# Altium schematic sheet Motor_Power.SchDoc
size A3; DrawnBy: Caner ALP; DocumentNumber: 3; SheetNumber: 3; SheetTotal: 4
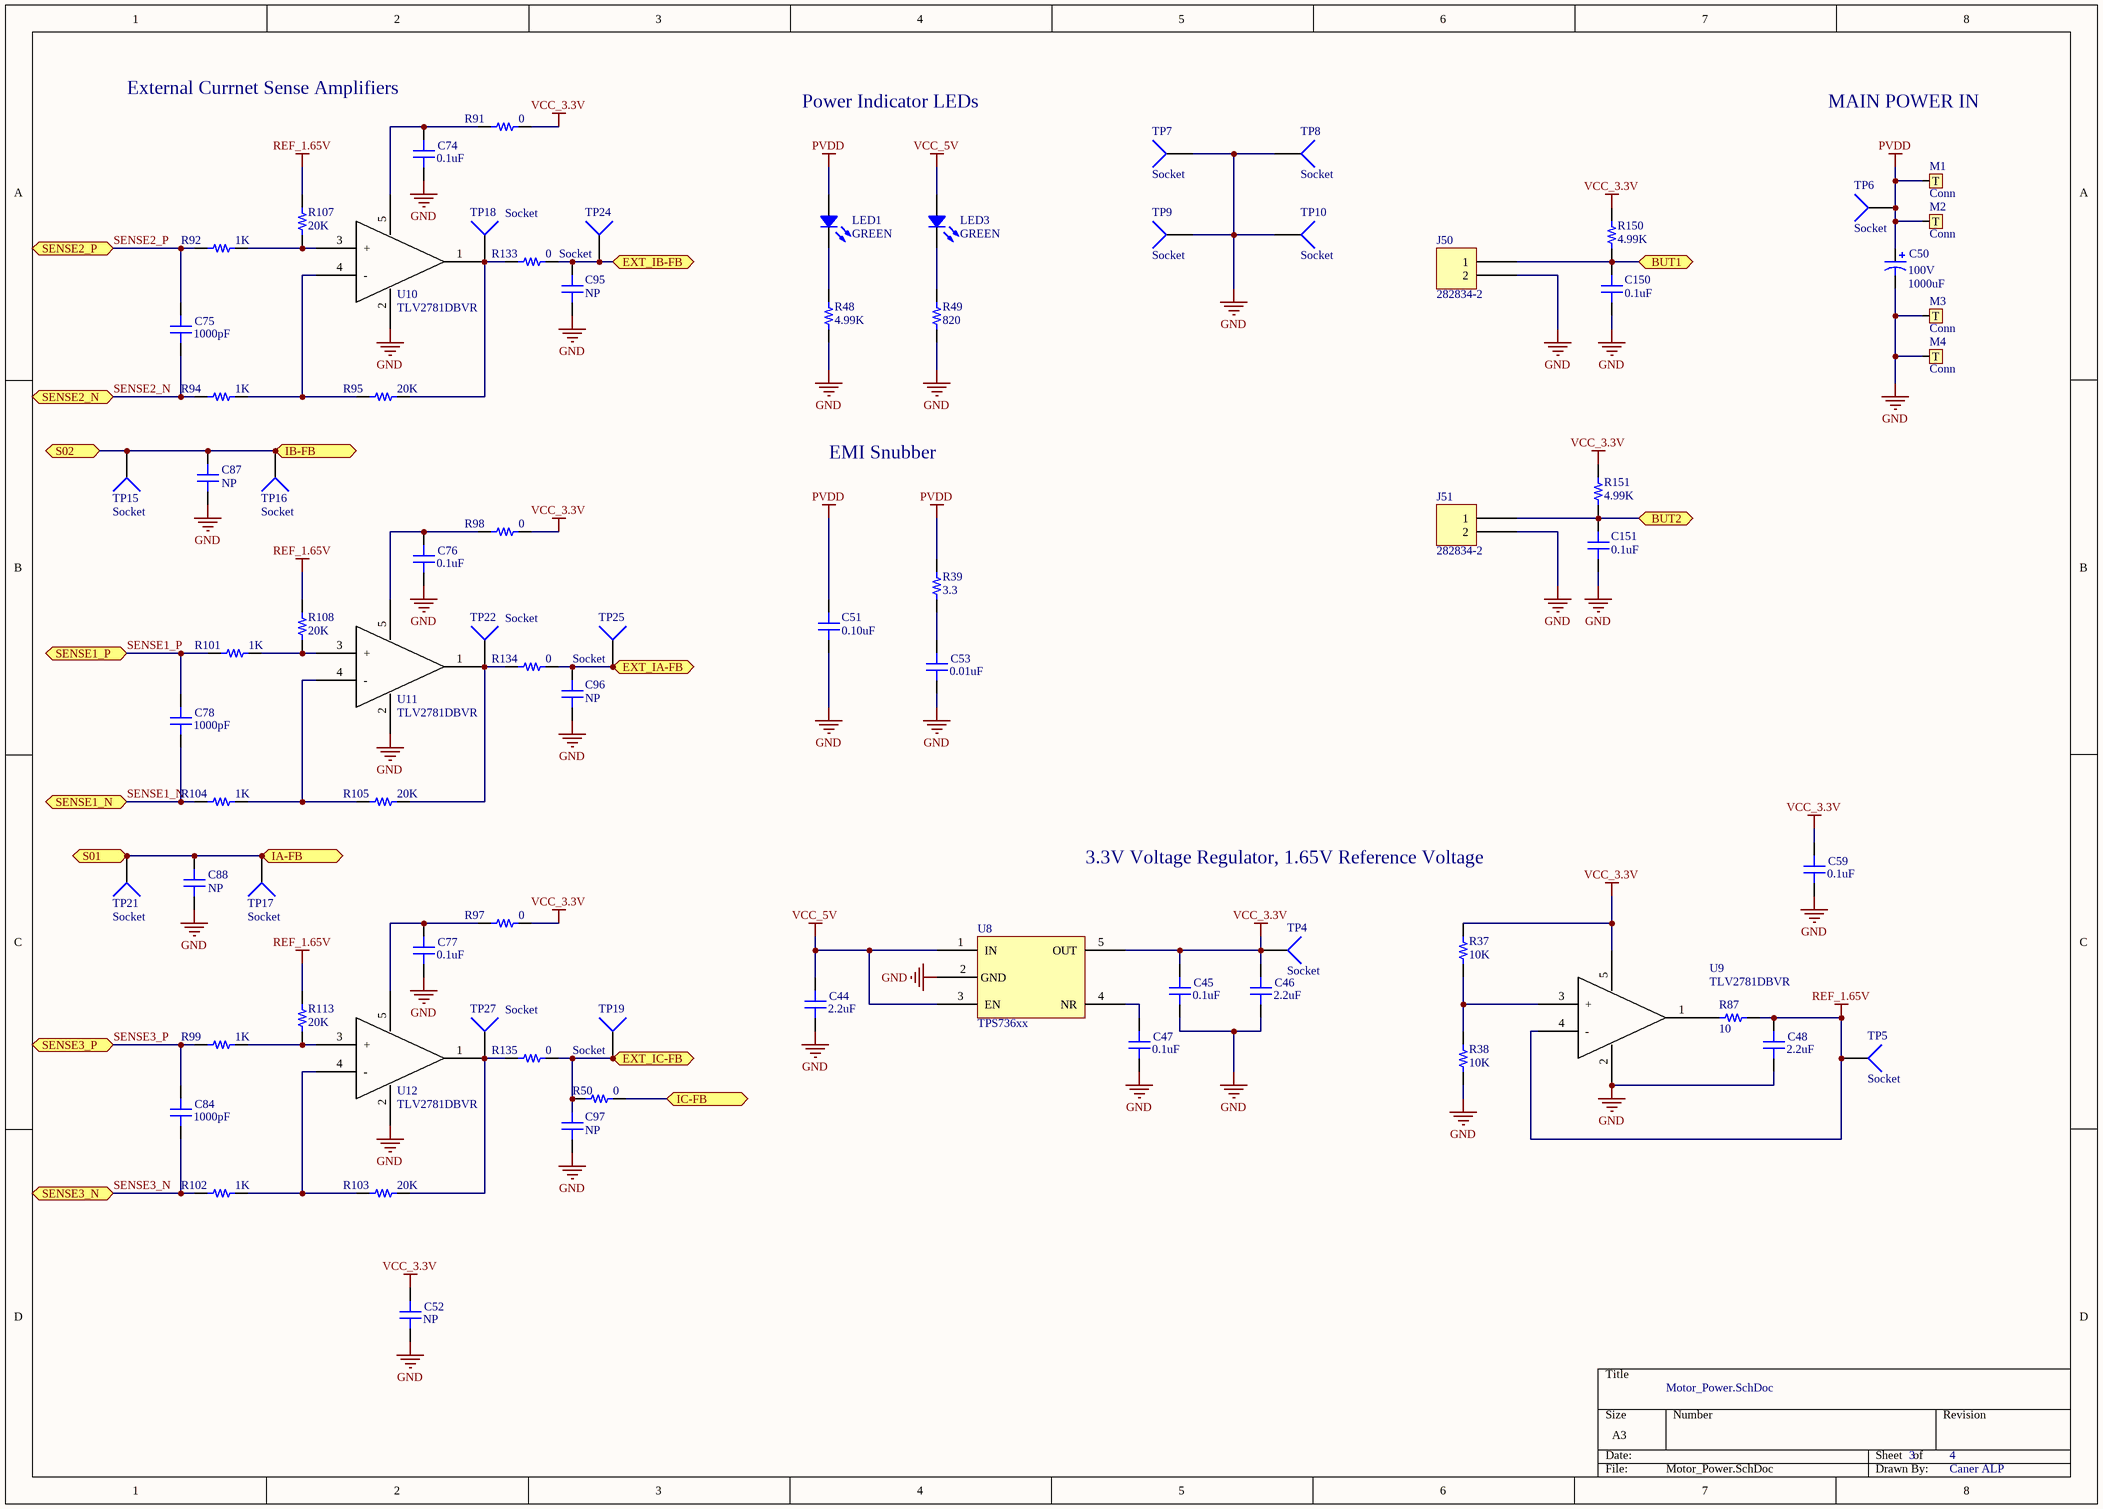
[diagram p0: Motor_Power.SchDoc]

## Parts
C44  2.2uF  [CAP 0603/1608]
C45  0.1uF  [CAP 0603/1608]
C46  2.2uF  [CAP 0603/1608]
C47  0.1uF  [CAP 0603/1608]
C48  2.2uF  [CAP 0603/1608]
C50  100V  value 1000uF  [CAPPR7.5-18x35.5]
C51  0.10uF  [CAP 0805/2012]
C52  NP  [CAP 0603/1608]
C53  0.01uF  [CAP 0603/1608]
C59  0.1uF  [CAP 0603/1608]
C74  0.1uF  [CAP 0603/1608]
C75  1000pF  [CAP 0603/1608]
C76  0.1uF  [CAP 0603/1608]
C77  0.1uF  [CAP 0603/1608]
C78  1000pF  [CAP 0603/1608]
C84  1000pF  [CAP 0603/1608]
C87  NP  [CAP 0603/1608]
C88  NP  [CAP 0603/1608]
C95  NP  [CAP 0603/1608]
C96  NP  [CAP 0603/1608]
C97  NP  [CAP 0603/1608]
C150  0.1uF  [CAP 0603/1608]
C151  0.1uF  [CAP 0603/1608]
J50  282834-2  [TE 282834-2]
J51  282834-2  [TE 282834-2]
LED1  GREEN  [LED 0805/2012 YELLOW]
LED3  GREEN  [LED 0805/2012 YELLOW]
M1  Conn  [M5 Nut]
M2  Conn  [M5 Nut]
M3  Conn  [M5 Nut]
M4  Conn  [M5 Nut]
R37  10K  [RES 0603/1608]
R38  10K  [RES 0603/1608]
R39  3.3  [RES 1206/3216]
R48  4.99K  [RES 0603/1608]
R49  820  [RES 0603/1608]
R50  0  [RES 0603/1608]
R87  10  [RES 0603/1608]
R91  0  [RES 0603/1608]
R92  1K  [RES 0603/1608]
R94  1K  [RES 0603/1608]
R95  20K  [RES 0603/1608]
R97  0  [RES 0603/1608]
R98  0  [RES 0603/1608]
R99  1K  [RES 0603/1608]
R101  1K  [RES 0603/1608]
R102  1K  [RES 0603/1608]
R103  20K  [RES 0603/1608]
R104  1K  [RES 0603/1608]
R105  20K  [RES 0603/1608]
R107  20K  [RES 0603/1608]
R108  20K  [RES 0603/1608]
R113  20K  [RES 0603/1608]
R133  0  [RES 0603/1608]
R134  0  [RES 0603/1608]
R135  0  [RES 0603/1608]
R150  4.99K  [RES 0603/1608]
R151  4.99K  [RES 0603/1608]
TP4  Socket  [PIN1]
TP5  Socket  [PIN1]
TP6  Socket  [PIN1]
TP7  Socket  [PIN1]
TP8  Socket  [PIN1]
TP9  Socket  [PIN1]
TP10  Socket  [PIN1]
TP15  Socket  [PIN1]
TP16  Socket  [PIN1]
TP17  Socket  [PIN1]
TP18  Socket  [PIN1]
TP19  Socket  [PIN1]
TP21  Socket  [PIN1]
TP22  Socket  [PIN1]
TP24  Socket  [PIN1]
TP25  Socket  [PIN1]
TP27  Socket  [PIN1]
U8  TPS736xx  [DBV005]
U9  TLV2781DBVR  [DBV005]
U10  TLV2781DBVR  [DBV005]
U11  TLV2781DBVR  [DBV005]
U12  TLV2781DBVR  [DBV005]

## Ports
BUT1, BUT2, EXT_IA-FB, EXT_IB-FB, EXT_IC-FB, IA-FB, IB-FB, IC-FB, S01, S02, SENSE1_N, SENSE1_P, SENSE2_N, SENSE2_P, SENSE3_N, SENSE3_P

## Nets
GND: C44.1 C45.1 C46.1 C47.1 C48.1 C50.2 C51.1 C52.1 C53.1 C59.1 C74.1 C76.1 C77.1 C87.1 C88.1 C95.1 C96.1 C97.1 C150.1 C151.1 J50.2 J51.2 M3.1(T) M4.1(T) R38.2 R48.1 R49.1 TP7.1 TP8.1 TP9.1 TP10.1 U8.2(GND) U9.2 U10.2 U11.2 U12.2
PVDD: C50.1 C51.2 LED1.1 M1.1(T) M2.1(T) R39.2 TP6.1
REF_1.65V: C48.2 R87.2 R107.1 R108.1 R113.1 TP5.1 U9.4(-)
VCC_3.3V: C45.2 C46.2 C52.2 C59.2 R37.1 R91.1 R97.1 R98.1 R150.2 R151.2 TP4.1 U8.5(OUT) U9.5
VCC_5V: C44.2 LED3.1 U8.1(IN) U8.3(EN)
BUT1: C150.2 J50.1 R150.1 ; port BUT1
BUT2: C151.2 J51.1 R151.1 ; port BUT2
EXT_IA-FB: C96.2 R134.1 TP25.1 ; port EXT_IA-FB
EXT_IB-FB: C95.2 R133.1 TP24.1 ; port EXT_IB-FB
EXT_IC-FB: C97.2 R50.2 R135.1 TP19.1 ; port EXT_IC-FB
IA-FB: C88.2 TP17.1 TP21.1 ; port IA-FB, port S01
IB-FB: C87.2 TP15.1 TP16.1 ; port IB-FB, port S02
IC-FB: R50.1 ; port IC-FB
SENSE1_N: C78.1 R104.2 ; port SENSE1_N
SENSE1_P: C78.2 R101.2 ; port SENSE1_P
SENSE2_N: C75.1 R94.2 ; port SENSE2_N
SENSE2_P: C75.2 R92.2 ; port SENSE2_P
SENSE3_N: C84.1 R102.2 ; port SENSE3_N
SENSE3_P: C84.2 R99.2 ; port SENSE3_P
NetC47_2: C47.2 U8.4(NR)
NetC53_2: C53.2 R39.1
NetC74_2: C74.2 R91.2 U10.5
NetC76_2: C76.2 R98.2 U11.5
NetC77_2: C77.2 R97.2 U12.5
NetLED1_2: LED1.2 R48.2
NetLED3_2: LED3.2 R49.2
NetR37_2: R37.2 R38.1 U9.3(+)
NetR87_1: R87.1 U9.1
NetR92_1: R92.1 R107.2 U10.3(+)
NetR94_1: R94.1 R95.2 U10.4(-)
NetR95_1: R95.1 R133.2 TP18.1 U10.1
NetR99_1: R99.1 R113.2 U12.3(+)
NetR101_1: R101.1 R108.2 U11.3(+)
NetR102_1: R102.1 R103.2 U12.4(-)
NetR103_1: R103.1 R135.2 TP27.1 U12.1
NetR104_1: R104.1 R105.2 U11.4(-)
NetR105_1: R105.1 R134.2 TP22.1 U11.1

## Notes on the sheet
- External Currnet Sense Amplifiers
- Power Indicator LEDs
- MAIN POWER IN
- EMI Snubber
- 3.3V Voltage Regulator, 1.65V Reference Voltage

## Library data of the parts
C44-C48 C52 C53 C59 C74-C78 C84 C87 C88 C95-C97 C150 C151 = CC0603KPX7R7BB104: CAP CER 0.1UF 16V X7R 0603; Manufacturer: Yageo; TemperatureRange: -55C ~ 125C; Tolerance: 10%; Value: 0.1uF; Part Number: CC0603KPX7R7BB104; PartId: 5262; Supplier 1: Digi-Key; Supplier Part Number 1: 311-1335-2-ND; ComponentLink1Description: Datasheet; ComponentLink1URL: http://www.yageo.com/documents/recent/UPY-GPHC_X7R_6.3V-to-50V-v12.pdf; ComponentLink2Description: Digi-Key listing; ComponentLink2URL: http://digikey.com/product-detail/en/CC0603KPX7R7BB104/311-1335-2-ND/2103073; TemperatureCoefficient: X7R; Voltage: 16V; Price: 0,0043; Type: -; Device Package: 0603 (1608 Metric)
C50 = Cap Pol1: Polarized Capacitor (Radial); Published: 8-Jun-2000; LatestRevisionDate: 17-Jul-2002; LatestRevisionNote: Re-released for DXP Platform.; PackageReference: RB7.6-15; Publisher: Altium Limited; PackageDescription: Polarized Capacitor (Radial); 2 Leads
C51 = C0805C104K1RACTU: CAP CER 0.1UF 100V X7R 0805; Manufacturer: Kemet; TemperatureRange: -55C ~ 125C; Tolerance: 10%; Value: 0.10uF; Part Number: C0805C104K1RACTU; PartId: 13746; Supplier 1: Digi-Key; Supplier Part Number 1: 399-3486-2-ND; ComponentLink1Description: Datasheet; ComponentLink1URL: http://www.kemet.com/docfinder?Partnumber=C0805C104K1RACTU; ComponentLink2Description: Digi-Key Listing; ComponentLink2URL: https://www.digikey.com/product-detail/en/kemet/C0805C104K1RACTU/399-3486-2-ND/754748; TemperatureCoefficient: X7R; Voltage: 100V; Price: 0,0462; Device Package: 0805 (2012 Metric)
J50 J51 = 282834-2: TERM BLOCK 2POS SIDE ENT 2.54MM; Manufacturer: TE Connectivity AMP Connectors; TemperatureRange: -40C ~ 105C; Voltage: 150V; Pitch: 0.100" (2.54mm); Number Of Levels: 1; Positions Per Level: 2; Part Number: 282834-2; PartId: 9289; Supplier 1: Digi-Key; Supplier Part Number 1: A98333-ND; ComponentLink1Description: Datasheet; ComponentLink1URL: http://www.te.com/commerce/DocumentDelivery/DDEController?Action=srchrtrv&DocNm=282834&DocType=Customer+Drawing&DocLang=English; ComponentLink2Description: Digi-Key Listing; ComponentLink2URL: http://www.digikey.ca/product-detail/en/282834-2/A98333-ND/1150135; Price: 1,3; Colour: Green; Orientation: Horizontal with Board
LED1 LED3 = LTST-C170KFKT: LED ORANGE CLEAR 0805 SMD; Manufacturer: Lite-On Inc.; Type: Surface Mount; Millicandela: 90mcd; Voltage Forward: 2V; Current (Test): 20mA; Viewing Angle: 130; Value: Green; Part Number: LTST-C170KFKT; PartId: 7079; Supplier 1: Digi-Key; Supplier Part Number 1: 160-1413-2-ND; ComponentLink1Description: Datasheet; ComponentLink1URL: http://optoelectronics.liteon.com/upload/download/DS-22-99-0185/S_110_LTST-C170KFKT.pdf; ComponentLink2Description: Digi-Key Listing; ComponentLink2URL: http://www.digikey.ca/product-detail/en/LTST-C170KFKT/160-1413-2-ND/386775; Price: 0,0638; Device Package: 0805 (2012 Metric); Colour: Orange; Lens Transparency: Clear
M1-M4 = 1 Conn
R37 R38 R48-R50 R87 R91 R92 R94 R95 R97-R99 R101-R105 R107 R108 R113 R133-R135 R150 R151 = ERJ-3GEYJ331V: RES SMD 330 OHM 5% 1/10W 0603; Manufacturer: Panasonic Electronic Components; Value: 330; TemperatureRange: -55C ~ 155C; TemperatureCoefficient: 200ppm/C; PowerRating: 0.1W, 1/10W; Part Number: ERJ-3GEYJ331V; PartId: 11189; Supplier 1: Digi-Key; Supplier Part Number 1: P330GTR-ND; ComponentLink1Description: Datasheet; ComponentLink1URL: http://industrial.panasonic.com/www-cgi/jvcr13pz.cgi?E+PZ+3+AOA0001+ERJ3GEYJ331V+7+WW; ComponentLink2Description: Digi-Key Listing; ComponentLink2URL: https://www.digikey.com/product-detail/en/panasonic-electronic-components/ERJ-3GEYJ331V/P330GTR-ND/135755; Tolerance: 5%; Price: 0,002; Device Package: 0603 (1608 Metric)
R39 = ERJ-8GEYJ3R3V: RES SMD 3.3 OHM 5% 1/4W 1206; Manufacturer: Panasonic Electronic Components; TemperatureRange: -55C ~ 155C; TemperatureCoefficient: -100/ +600ppm/C; PowerRating: 0.25W, 1/4W; Value: 3.3; Part Number: ERJ-8GEYJ3R3V; PartId: 11912; Supplier 1: Digi-Key; Supplier Part Number 1: P3.3ETR-ND; ComponentLink1Description: Datasheet; ComponentLink1URL: http://industrial.panasonic.com/www-cgi/jvcr13pz.cgi?E+PZ+3+AOA0001+ERJ8GEYJ3R3V+7+WW; ComponentLink2Description: Digi-Key Listing; ComponentLink2URL: https://www.digikey.com/product-detail/en/panasonic-electronic-components/ERJ-8GEYJ3R3V/P3.3ETR-ND/282206; Tolerance: 5%; Price: 0,0045; Device Package: 1206 (3216 Metric)
U8 = TPS736xx: LDO
TP4-TP10 TP15-TP19 TP21 TP22 TP24 TP25 TP27 = Socket: LatestRevisionDate: 17-Jul-2002; LatestRevisionNote: Re-released for DXP Platform.; Publisher: Altium Limited